# Altium schematic sheet Sensor.SchDoc
size A; SheetNumber: 4; SheetTotal: 6
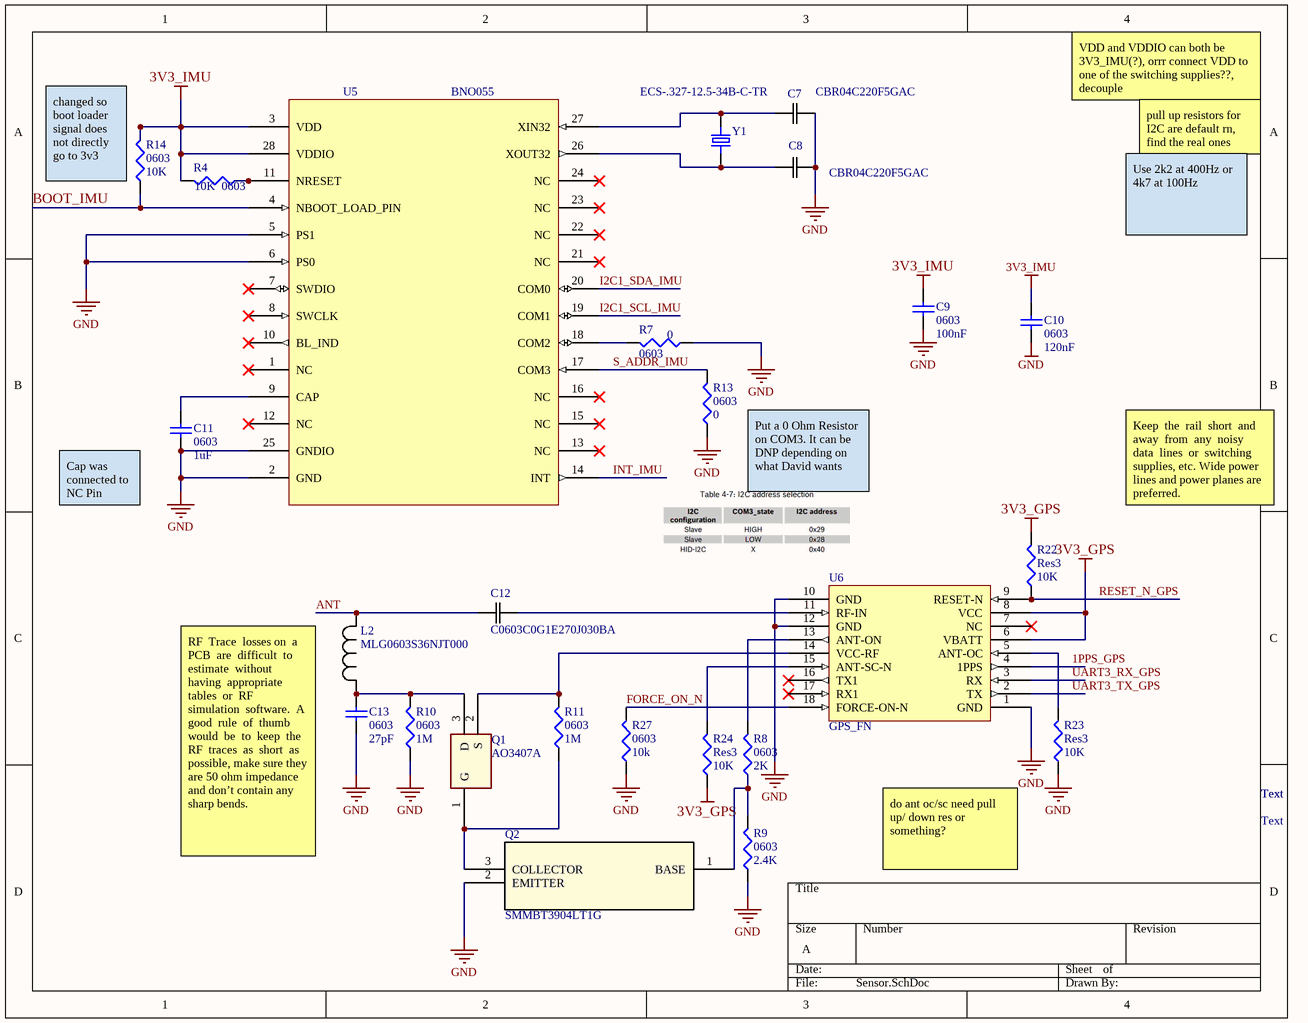
[diagram p0: Sensor.SchDoc]

## Parts
C7  CBR04C220F5GAC  [CAPC10555_55N_KEM]
C8  CBR04C220F5GAC  [CAPC10555_55N_KEM]
C9  0603  value 100nF  [1608[0603]]
C10  0603  value 120nF  [1608[0603]]
C11  0603  value 1uF  [1608[0603]]
C12  C0603C0G1E270J030BA  [CAP_0603_TDK]
C13  0603  value 27pF  [1608[0603]]
L2  MLG0603S36NJT000  [IND_0603_TDK]
Q1  AO3407A  [SOT-23-3L_AOS]
Q2  SMMBT3904LT1G  [SOT-23-3_1P4X3P040_ONS]
R4  0603  value 10K  [J1-0603]
R7  0603  value 0  [J1-0603]
R8  0603  value 2K  [J1-0603]
R9  0603  value 2.4K  [J1-0603]
R10  0603  value 1M  [J1-0603]
R11  0603  value 1M  [J1-0603]
R13  0603  value 0  [J1-0603]
R14  0603  value 10K  [J1-0603]
R22  Res3  value 10K  [J1-0603]
R23  Res3  value 10K  [J1-0603]
R24  Res3  value 10K  [J1-0603]
R27  0603  value 10k  [J1-0603]
U5  BNO055  [QFN_BNO055_BOS]
U6  GPS_FN  [SL871]
Y1  ECS-.327-12.5-34B-C-TR  [XTAL_ECS-.327-12.5-34B-C-TR]

## Nets
3V3_GPS: R22.2 R24.1 U6.6(VBATT) U6.8(VCC)
3V3_IMU: C9.2 C10.2 R4.2 R14.2 U5.3(VDD) U5.28(VDDIO)
GND: C7.2 C8.2 C9.1 C10.1 C11.1 C13.1 Q2.2(EMITTER) R7.1 R9.1 R10.1 R13.1 R23.1 R27.1 U5.2(GND) U5.5(PS1) U5.6(PS0) U5.25(GNDIO) U6.1(GND) U6.10(GND) U6.12(GND)
1PPS_GPS: U6.4(1PPS)
ANT: C12.1 L2.1
BOOT_IMU: R14.1 U5.4(NBOOT_LOAD_PIN)
FORCE_ON_N: R27.2 U6.18(FORCE-ON-N)
I2C1_SCL_IMU: U5.19(COM1)
I2C1_SDA_IMU: U5.20(COM0)
INT_IMU: U5.14(INT)
RESET_N_GPS: R22.1 U6.9(RESET-N)
S_ADDR_IMU: R13.2 U5.17(COM3)
UART3_RX_GPS: U6.3(RX)
UART3_TX_GPS: U6.2(TX)
NetC7_1: C7.1 U5.27(XIN32) Y1.2
NetC8_1: C8.1 U5.26(XOUT32) Y1.1
NetC11_2: C11.2 U5.9(CAP)
NetC12_2: C12.2 U6.11(RF-IN)
NetC13_2: C13.2 L2.2 Q1.3(D) R10.2
NetQ1_1: Q1.1(G) Q2.3(COLLECTOR) R11.1
NetQ1_2: Q1.2(S) R11.2 U6.14(VCC-RF)
NetQ2_1: Q2.1(BASE) R8.1 R9.2
NetR4_1: R4.1 U5.11(NRESET)
NetR7_2: R7.2 U5.18(COM2)
NetR8_2: R8.2 U6.13(ANT-ON)
NetR23_2: R23.2 U6.5(ANT-OC)
NetR24_2: R24.2 U6.15(ANT-SC-N)

Not connected (* = marked no-connect by the designer): U5 1(NC)* 7(SWDIO)* 8(SWCLK)* 10(BL_IND)* 12(NC)* 13(NC)* 15(NC)* 16(NC)* 21(NC)* 22(NC)* 23(NC)* 24(NC)*; U6 7(NC)* 16(TX1)* 17(RX1)*

## Notes on the sheet
- VDD and VDDIO can both be 3V3_IMU(?), orrr connect VDD to one of the switching supplies??, decouple
- pull up resistors for I2C are default rn, find the real ones
- (near R14) changed so boot loader signal does not directly go to 3v3
- Use 2k2 at 400Hz or 4k7 at 100Hz
- (near C11) Cap was connected to NC Pin
- (near R13) Put a 0 Ohm Resistor on COM3. It can be DNP depending on what David wants
- Keep  the  rail  short  and  away  from  any  noisy  data  lines  or  switching  supplies, etc. Wide power lines and power planes are preferred.
- Text
- RF  Trace  losses on  a  PCB  are  difficult  to  estimate  without  having  appropriate  tables  or  RF  simulation  software.  A  good  rule  of  thumb  would  be  to  keep  the  RF  traces  as  short  as  possible, make sure they are 50 ohm impedance and don’t contain any sharp bends.
- (near R23) do ant oc/sc need pull up/ down res or something?

## Library data of the parts
C7 C8 = CBR04C220F5GAC: No Description Available; Mfr_Name: Kemet; Type: DEV; Copyright: Copyright (C) 2023 Ultra Librarian. All rights reserved.; Manufacturer_Part_Number: CBR04C220F5GAC; Digi-Key_Part_Number_1: 399-8827-1-ND; Digi-Key_Part_Number_2: 399-8827-2-ND; Digi-Key_Part_Number_3: 399-8827-6-ND; RefDes: RefDes
C9-C11 C13 = Cap Semi: Capacitor (Semiconductor SIM Model); Published: 8-Jun-2000; LatestRevisionDate: 29-May-2009; LatestRevisionNote: IPC-7351 Footprint Added.; PackageReference: C1206; Publisher: Altium Limited; PackageDescription: Chip Capacitor
C12 = C0603C0G1E270J030BA: No Description Available; Mfr_Name: TDK; Type: DEV; Copyright: Copyright (C) 2023 Ultra Librarian. All rights reserved.; Manufacturer_Part_Number: C0603C0G1E270J030BA; Digi-Key_Part_Number_1: 445-4661-1-ND; Digi-Key_Part_Number_2: 445-4661-2-ND; Digi-Key_Part_Number_3: 445-4661-6-ND; RefDes: RefDes
L2 = MLG0603S36NJT000: No Description Available; Mfr_Name: TDK; Type: DEV; Copyright: Copyright (C) 2023 Ultra Librarian. All rights reserved.; Manufacturer_Part_Number: MLG0603S36NJT000; Digi-Key_Part_Number_1: 445-6298-1-ND; Digi-Key_Part_Number_2: 445-6298-2-ND; Digi-Key_Part_Number_3: 445-6298-6-ND; RefDes: RefDes
Q1 = AO3407A: No Description Available; Mfr_Name: Alpha and Omega Semiconductor; Type: DEV; Copyright: Copyright (C) 2023 Ultra Librarian. All rights reserved.; Manufacturer_Part_Number: AO3407A; Digi-Key_Part_Number_1: 785-1006-2-ND; Digi-Key_Part_Number_2: 785-1006-1-ND; Digi-Key_Part_Number_3: 785-1006-6-ND; Digi-Key_Part_Number_4: 785-1006-2-NDL; RefDes: RefDes
Q2 = SMMBT3904LT1G: No Description Available; Mfr_Name: onsemi; Type: DEV; Copyright: Copyright (C) 2023 Ultra Librarian. All rights reserved.; Manufacturer_Part_Number: SMMBT3904LT1G; Digi-Key_Part_Number_1: SMMBT3904LT1GOSTR-ND; Digi-Key_Part_Number_2: SMMBT3904LT1GOSCT-ND; Digi-Key_Part_Number_3: SMMBT3904LT1GOSDKR-ND; RefDes: RefDes
R4 R7-R11 R13 R14 R22-R24 R27 = Res3: Resistor; Published: 8-Jun-2000; LatestRevisionDate: 29-May-2009; LatestRevisionNote: IPC-7351 Footprint Added.; PackageReference: J1-0603; Publisher: Altium Limited; PackageDescription: Chip Resistor
U5 = BNO055: No Description Available; Mfr_Name: Bosch Sensortec; Copyright: Copyright (C) 2023 Ultra Librarian. All rights reserved.; Manufacturer_Part_Number: BNO055; Digi-Key_Part_Number_1: 828-1058-1-ND; Digi-Key_Part_Number_2: 828-1058-2-ND; Digi-Key_Part_Number_3: 828-1058-6-ND; RefDes: RefDes; Type: DEV
Y1 = ECS-.327-12.5-34B-C-TR: 32.768kHz Â±10ppm Crystal 12.5pF 70 kOhms 2-SMD, No Lead; MF: ECS Inc.; Digi-Key_Part_Number: XC1968CT-ND; Package: SMD-2 ECS International; DigiKey-Purchase-URL: https://snapeda.com/shop?store=DigiKey&id=55051; MP: ECS-.327-12.5-34B-C-TR; SnapEDA_Link: https://www.snapeda.com/parts/ECS-.327-12.5-34B-C-TR/ECS%20Inc./view-part/55051/?ref=snap; Value: *